# EAGLE schematic lat_stm_rpi (EAGLE 9.6.2)
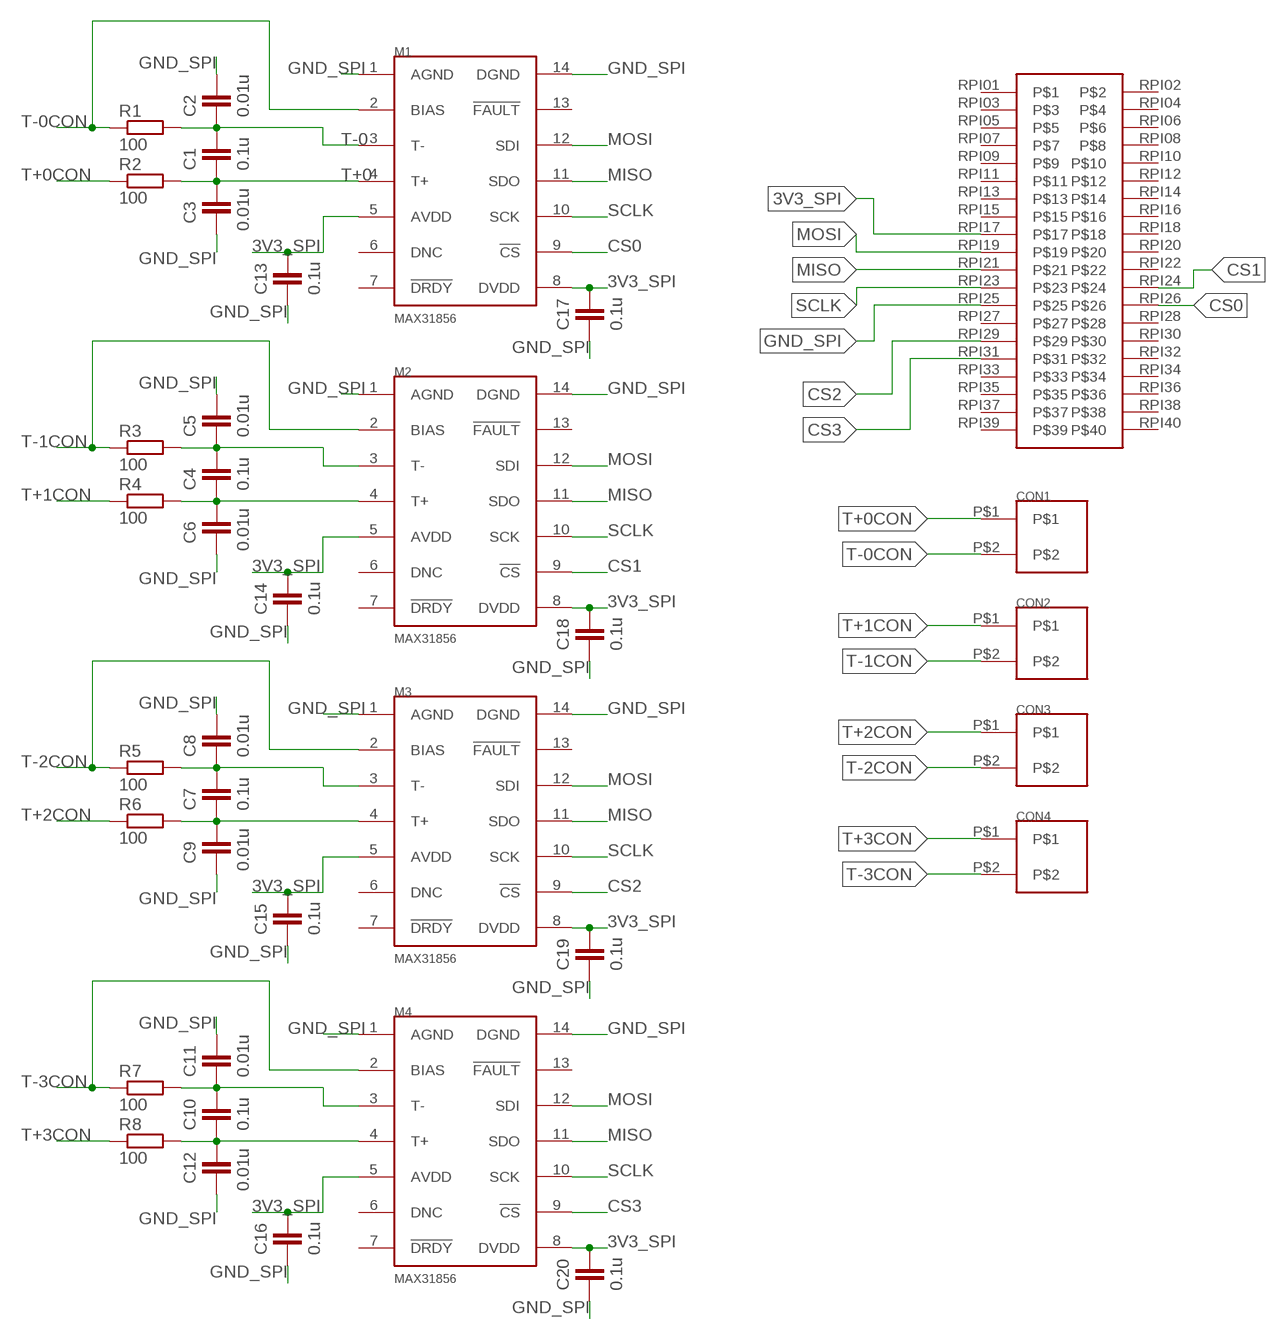
[diagram p0: schematic, sheet 1]

## Parts
C1  0.1u  C-EUC0603  [C0603]
C2  0.01u  C-EUC0603  [C0603]
C3  0.01u  C-EUC0603  [C0603]
C4  0.1u  C-EUC0603  [C0603]
C5  0.01u  C-EUC0603  [C0603]
C6  0.01u  C-EUC0603  [C0603]
C7  0.1u  C-EUC0603  [C0603]
C8  0.01u  C-EUC0603  [C0603]
C9  0.01u  C-EUC0603  [C0603]
C10  0.1u  C-EUC0603  [C0603]
C11  0.01u  C-EUC0603  [C0603]
C12  0.01u  C-EUC0603  [C0603]
C13  0.1u  C-EUC0603  [C0603]
C14  0.1u  C-EUC0603  [C0603]
C15  0.1u  C-EUC0603  [C0603]
C16  0.1u  C-EUC0603  [C0603]
C17  0.1u  C-EUC0603  [C0603]
C18  0.1u  C-EUC0603  [C0603]
C19  0.1u  C-EUC0603  [C0603]
C20  0.1u  C-EUC0603  [C0603]
CON1  893-1332  [893-1332]
CON2  893-1332  [893-1332]
CON3  893-1332  [893-1332]
CON4  893-1332  [893-1332]
M1  MAX31856  [TSSOP14]
M2  MAX31856  [TSSOP14]
M3  MAX31856  [TSSOP14]
M4  MAX31856  [TSSOP14]
R1  100  R-EU_R0603  [R0603]
R2  100  R-EU_R0603  [R0603]
R3  100  R-EU_R0603  [R0603]
R4  100  R-EU_R0603  [R0603]
R5  100  R-EU_R0603  [R0603]
R6  100  R-EU_R0603  [R0603]
R7  100  R-EU_R0603  [R0603]
R8  100  R-EU_R0603  [R0603]
RPC1  RPI_CON  [RPI_CON]

## Nets
3V3_SPI [dev]: C13.1 C14.1 C15.1 C16.1 C17.1 C18.1 C19.1 C20.1 M1.5(AVDD) M1.8(DVDD) M2.5(AVDD) M2.8(DVDD) M3.5(AVDD) M3.8(DVDD) M4.5(AVDD) M4.8(DVDD) RPC1.RPI17
CS0 [dev]: M1.9(!CS) RPC1.RPI26
CS1 [dev]: M2.9(!CS) RPC1.RPI24
CS2 [dev]: M3.9(!CS) RPC1.RPI29
CS3 [dev]: M4.9(!CS) RPC1.RPI31
GND_SPI [dev]: C2.1 C3.2 C5.1 C6.2 C8.1 C9.2 C11.1 C12.2 C13.2 C14.2 C15.2 C16.2 C17.2 C18.2 C19.2 C20.2 M1.1(AGND) M1.14(DGND) M2.1(AGND) M2.14(DGND) M3.1(AGND) M3.14(DGND) M4.1(AGND) M4.14(DGND) RPC1.RPI25
MISO [spi_bus]: M1.11(SDO) M2.11(SDO) M3.11(SDO) M4.11(SDO) RPC1.RPI21
MOSI [spi_bus]: M1.12(SDI) M2.12(SDI) M3.12(SDI) M4.12(SDI) RPC1.RPI19
SCLK [spi_bus]: M1.10(SCK) M2.10(SCK) M3.10(SCK) M4.10(SCK) RPC1.RPI23
T+0 [tc]: C1.2 C3.1 M1.4(T+) R2.2
T+0CON [tc]: CON1.P$1 R2.1
T+1 [tc]: C4.2 C6.1 M2.4(T+) R4.2
T+1CON [tc]: CON2.P$1 R4.1
T+2 [tc]: C7.2 C9.1 M3.4(T+) R6.2
T+2CON [tc]: CON3.P$1 R6.1
T+3 [tc]: C10.2 C12.1 M4.4(T+) R8.2
T+3CON [tc]: CON4.P$1 R8.1
T-0 [tc]: C1.1 C2.2 M1.3(T-) R1.2
T-0CON [tc]: CON1.P$2 M1.2(BIAS) R1.1
T-1 [tc]: C4.1 C5.2 M2.3(T-) R3.2
T-1CON [tc]: CON2.P$2 M2.2(BIAS) R3.1
T-2 [tc]: C7.1 C8.2 M3.3(T-) R5.2
T-2CON [tc]: CON3.P$2 M3.2(BIAS) R5.1
T-3 [tc]: C10.1 C11.2 M4.3(T-) R7.2
T-3CON [tc]: CON4.P$2 M4.2(BIAS) R7.1
Unconnected: M1.6(DNC) M1.7(!DRDY) M1.13(!FAULT) M2.6(DNC) M2.7(!DRDY) M2.13(!FAULT) M3.6(DNC) M3.7(!DRDY) M3.13(!FAULT) M4.6(DNC) M4.7(!DRDY) M4.13(!FAULT) RPC1.RPI01 RPC1.RPI02 RPC1.RPI03 RPC1.RPI04 RPC1.RPI05 RPC1.RPI06 RPC1.RPI07 RPC1.RPI08 RPC1.RPI09 RPC1.RPI10 RPC1.RPI11 RPC1.RPI12 RPC1.RPI13 RPC1.RPI14 RPC1.RPI15 RPC1.RPI16 RPC1.RPI18 RPC1.RPI20 RPC1.RPI22 RPC1.RPI27 RPC1.RPI28 RPC1.RPI30 RPC1.RPI32 RPC1.RPI33 RPC1.RPI34 RPC1.RPI35 RPC1.RPI36 RPC1.RPI37 RPC1.RPI38 RPC1.RPI39 RPC1.RPI40

## Library data of the parts
C1-C20 = rcl:C-EU: CAPACITOR, European symbol; SPICEPREFIX: C
CON1-CON4 = lib_test:893-1332
M1-M4 = lib_test:MAX31856
R1-R8 = rcl:R-EU_: RESISTOR, European symbol; SPICEPREFIX: R
RPC1 = lib_test:RPI_CON

## Net classes
0 default: width 0.254 mm, drill 0.305 mm, clearance 0.254 mm
1 spi_bus: width 0.254 mm, drill 0.305 mm, clearance 0.254 mm
2 spi_cs: width 0.254 mm, drill 0.305 mm, clearance 0.254 mm
3 tc: width 0.254 mm, drill 0.305 mm, clearance 0.254 mm
4 3v3: width 0.508 mm, drill 0.61 mm, clearance 0.508 mm
5 gnd: width 0.762 mm, drill 0.889 mm, clearance 0.254 mm
6 dev: width 0.254 mm, drill 0.254 mm, clearance 0.254 mm